# Altium project LMR_V1.PrjPcb
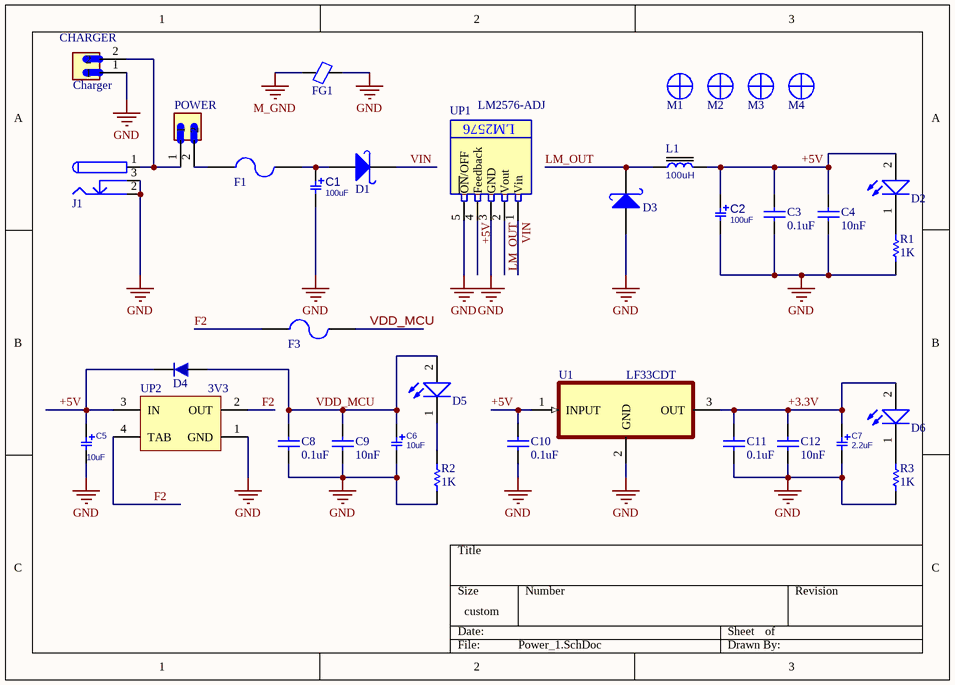
[diagram p0: Power_1.SchDoc]
6 sheets, 156 parts. Net scope: global (net labels, ports and power ports of the same name join across sheets).
Board file: Modified.PcbDoc
Sheets:
  Power_1.SchDoc
  Micro.SchDoc
  ETHERNET.SchDoc
  USB2Serial.SchDoc
  L298.SchDoc
  Prepherals.SchDoc

## Sheet Power_1.SchDoc
size 177 x 127 mm; SheetNumber: 1; SheetTotal: 6

### Parts
C1  100uF  [C_EL_10_10]
C2  100uF  [C_EL_10_10]
C3  0.1uF  [CAPC3413X12N]
C4  10nF  [CAPC3413X12N]
C5  10uF  [C_TN_6032]
C6  10uF  [C_TN_6032]
C7  2.2uF  [C_TN_6032]
C8  0.1uF  [CAPC3413X12N]
C9  10nF  [CAPC3413X12N]
C10  0.1uF  [CAPC3413X12N]
C11  0.1uF  [CAPC3413X12N]
C12  10nF  [CAPC3413X12N]
CHARGER  Charger  [JST_B2P-VH(LF)(SN)]
D1  1n5822  [DO-214AB(SMC)]  (value not drawn)
D2  LED SMD PACKAGE  [LED_SMD_0805]  (value not drawn)
D3  1n5822  [DO-214AB(SMC)]  (value not drawn)
D4  1n4007  [DIOM4629X24N]  (value not drawn)
D5  LED SMD PACKAGE  [LED_SMD_0805]  (value not drawn)
D6  LED SMD PACKAGE  [LED_SMD_0805]  (value not drawn)
F1  F=3A  [1206 FUSE]  (value not drawn)
F3  F=3A  [1206 FUSE]  (value not drawn)
FG1  Ferrite Bead SMD  [FB0805]  (value not drawn)
J1  DC Power Jack  [DC Power Jack 1]  (value not drawn)
L1  100uH  [L_12]
M1  Screw  [Board Screw 3mm]  (value not drawn)
M2  Screw  [Board Screw 3mm]  (value not drawn)
M3  Screw  [Board Screw 3mm]  (value not drawn)
M4  Screw  [Board Screw 3mm]  (value not drawn)
POWER  B2P-VH(LF)(SN)  [JST_B2P-VH(LF)(SN)]  (value not drawn)
R1  1K  [RESC3413X04N]
R2  1K  [RESC3413X04N]
R3  1K  [RESC3413X04N]
U1  LF33CDT  [TO228P972X240-3N]
UP1  LM2576-ADJ  [LM2576 SMD]
UP2  3V3  [SOT223]

### Nets
+3.3V: C7.1 C11.2 C12.2 D6.2(A) U1.3(OUT)
+5V: C2.1 C3.2 C4.2 C5.1 C10.2 D2.2(A) D4.2 L1.2 U1.1(INPUT) UP1.4(Feedback) UP2.3(IN)
GND: C1.2 C2.2 C3.1 C4.1 C5.2 C6.2 C7.2 C8.1 C9.1 C10.1 C11.1 C12.1 CHARGER.1 D3.1(A) FG1.2 J1.2 J1.3 R1.1 R2.1 R3.1 U1.2(GND) UP1.3(GND) UP1.5(~{ON}/OFF) UP2.1(GND)
M_GND: FG1.1
VDD_MCU: C6.1 C8.2 C9.2 D4.1 D5.2(A) F3.2
F2: F3.1 UP2.2(OUT) UP2.4(TAB)
LM_OUT: D3.2(K) L1.1 UP1.2(Vout)
VIN: D1.2(K) UP1.1(Vin)
NetC1_1: C1.1 D1.1(A) F1.2
NetCHARGER_2: CHARGER.2 J1.1 POWER.1
NetD2_1: D2.1(K) R1.2
NetD5_1: D5.1(K) R2.2
NetD6_1: D6.1(K) R3.2
NetF1_1: F1.1 POWER.2

### Notes on the sheet
- (in symbol LM2576-Adj) LM2576

### Library data of the parts
C1 C2 = CAP_SMD_EL: CAP, THD, ELEC,; MANF_P#: MANF_PART#; PARAM2: 20%; DESC: DESCRIPTION; DIST#: MOUSER; PARAM: 25V; PRICE: 10= 5$; MANF: MANF; ASSEMBLY: ASSEMBLY; VALUE: 100uF
C3 C4 C8-C12 = CAP SMD 0805: CAP 0805; Designer: Abbas Basereh; Desc.: CAP SMD 0805; Data: 16-12-2016
C5-C7 = CAP_SMD_TAN: CAP, SMD, TAN,; PARAM: 25V
  C5 C6: VALUE: 10uF
  C7: VALUE: 2.2uF
CHARGER POWER = B2P-VH(LF)(SN): Connector Header Through Hole 2 position 0.156 (3.96mm); MF: JST Sales; Price: None; Availability: In Stock; Package: None; MP: B2P-VH(LF)(SN); Value: *; SnapEDA_Link: https://www.snapeda.com/parts/B2P-VH(LF)(SN)/JST+Sales+America+Inc./view-part/?ref=snap; Purchase-URL: https://pricing.snapeda.com/search/part/B2P-VH(LF)(SN)/?ref=eda; Check_prices: https://www.snapeda.com/parts/B2P-VH(LF)(SN)/JST+Sales+America+Inc./view-part/?ref=eda
D1 D3 = 1N5822 SMD: Schottky Rectifiers; Part. No: SS34; Manufacturer: ON Semiconductor/Fairchild; Designer: Abbas Basereh; Link: https://www.aliexpress.com/item/Free-shipping-100pcs-1n5822-sma-smd-do-214ac-Schottky-diode-ss34/32337482329.html?spm=2114.01010208.3.1.zLZDsP&ws_ab_test=searchweb0_0,searchweb201602_4_10065_10068_10084_10083_10080_10082_10081_10060_10061_10062_10056_10055_10054_10059_10099_10078_10079_427_10073_10103_10102_10096_10052_10050_10051,searchweb201603_4&btsid=6e50dc92-ac69-45bc-a19e-209af19ce602; Link: http://www.tme.eu/en/details/ss34/smd-schottky-diodes/vishay/ss34-e357t/; Link: http://www.digikey.com/product-detail/en/on-semiconductor-fairchild/SS34/SS34FSCT-ND/2094459; Data: 16-12-2016
D2 D5 D6 = LED SMD PACKAGE: SMD Mono-color Chip LED Waterclear; Part Number: 150080BS75000; Peak Wavelength: 465 nm; Forward Voltage: 3.2 V; Published Date: Jan 2017; Publisher: Ali Hafizi
D4 = 1n4007 SMD M7: Standard Rectifiers; Part. No: M7; Manufacturer: DC COMPONENTS; Designer: Abbas Basereh; Link: http://www.tme.eu/en/details/m7/smd-universal-diodes/dc-components/; Link: https://www.aliexpress.com/item/Smd-tube-1n4007-m7-SMA/1213719741.html?spm=2114.01010208.3.1.ZyZ7bC&ws_ab_test=searchweb0_0,searchweb201602_4_10065_10068_10084_10083_10080_10082_10081_10060_10061_10062_10056_10055_10054_10059_10099_10078_10079_427_10073_10103_10102_10096_10052_10050_10051,searchweb201603_4&btsid=db2be5ca-e560-400a-b91c-484ab5ee228b; Data: 16-12-2016
F1 F3 = Fuse SMD1206: SMD Fuses 1206; Designer: Abbas Basereh; Desc.: SMD Fuses 1206; Data: 16-12-2016
FG1 = Ferrite Bead SMD Package: Designer: Ali Hafizi
J1 = DC Power Jack: DC Power Jack. Center Pin 2.5mm. Diameter: 5.7mm; Designer: Ali Hafizi; Company: Personal; Project Name: Laser; Adding Date: 10/21/2009
L1 = INDPWR_SMD: INDUCTOR, POWER, SMD; VALUE: 100uH
M1-M4 = Board Screw 3MM: Board Screw With Spacer
R1-R3 = RES 0805 0.125W: RES 0805; Designer: Abbas Basereh; Desc.: RES SMD 0805; Data: 16-12-2016
U1 = LF33CDT: Linear Voltage Regulator IC Positive Fixed 1 Output 500mA DPAK; MF: STMicroelectronics; MP: LF33CDT; Price: None; Purchase-URL: https://pricing.snapeda.com/search/part/LF33CDT/?ref=eda; Package: TO-252 STMicroelectronics; Check_prices: https://www.snapeda.com/parts/LF33CDT/STMicroelectronics/view-part/?ref=eda; Value: *; Availability: In Stock; SnapEDA_Link: https://www.snapeda.com/parts/LF33CDT/STMicroelectronics/view-part/?ref=snap
UP1 = LM2576-Adj: 1.2-50V, 3A variable output step-down switching voltage regulator; Designer: Abbas Basereh; Data: 16-12-2016; Link: *; Part.No: *; VALUE: LM2576-ADJ
UP2 = AMS1117-x.x: x.x Volt, 800mA Low-Dropout Linear Regulator, 4-pin SOT-223; Designer: Ali Hafizi; Data: 16-12-2016

## Sheet Micro.SchDoc
size 228 x 215 mm; SheetNumber: 2; SheetTotal: 6
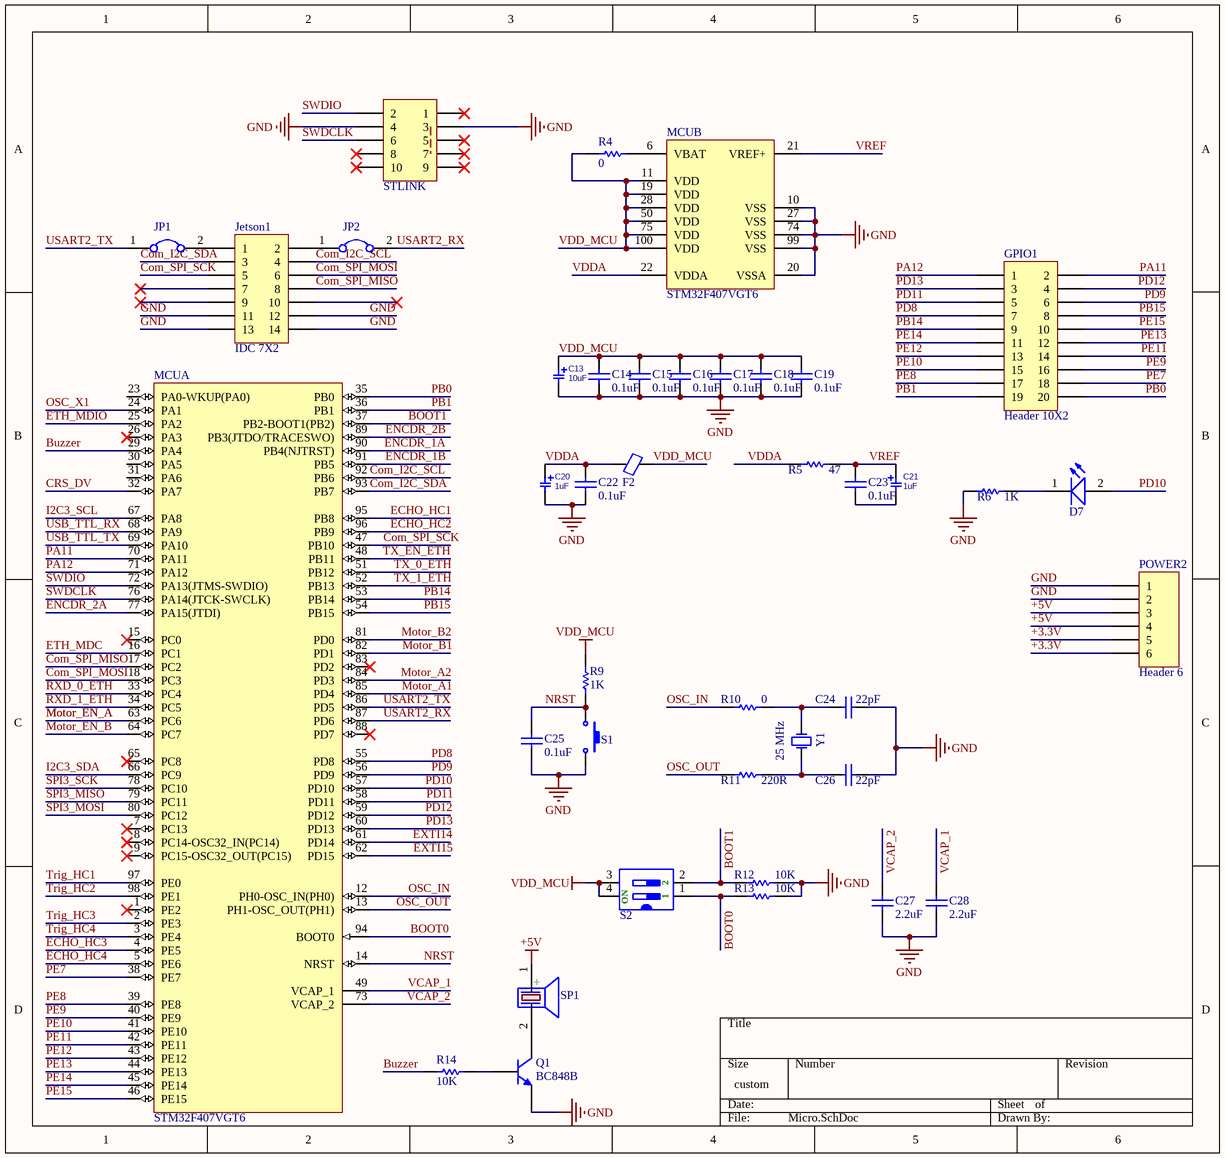
[diagram p1: Micro.SchDoc]

### Parts
C13  10uF  [C_TN_6032]
C14  0.1uF  [CAPC3413X12N]
C15  0.1uF  [CAPC3413X12N]
C16  0.1uF  [CAPC3413X12N]
C17  0.1uF  [CAPC3413X12N]
C18  0.1uF  [CAPC3413X12N]
C19  0.1uF  [CAPC3413X12N]
C20  1uF  [C_TN_6032]
C21  1uF  [C_TN_6032]
C22  0.1uF  [CAPC3413X12N]
C23  0.1uF  [CAPC3413X12N]
C24  22pF  [CAPC3413X12N]
C25  0.1uF  [CAPC3413X12N]
C26  22pF  [CAPC3413X12N]
C27  2.2uF  [CAPC3413X12N]
C28  2.2uF  [CAPC3413X12N]
D7  LED SMD PACKAGE  [LED_SMD_0805]  (value not drawn)
F2  Ferrite Bead SMD  [FB0805]  (value not drawn)
GPIO1  Header 10X2  [HDR2X10]
Jetson1  IDC 7X2  [IDC 7X2]
JP1  Jumper  [Jumper Small - 2.54 - GRAY]  (value not drawn)
JP2  Jumper  [Jumper Small - 2.54 - GRAY]  (value not drawn)
MCU  STM32F407VGT6  [STM-LQFP100_N]  (parts A,B of 2)
POWER2  Header 6  [HDR1X6]
Q1  BC848B  [SOT23_L]
R4  0  [RESC3413X04N]
R5  47  [RESC3413X04N]
R6  1K  [RESC3413X04N]
R9  1K  [RESC3413X04N]
R10  0  [RESC3413X04N]
R11  220R  [RESC3413X04N]
R12  10K  [RESC3413X04N]
R13  10K  [RESC3413X04N]
R14  10K  [RES0805_(2012X06L)]
S1  Switch PB  [SW-PB]  (value not drawn)
S2  SW_DIP_02  [SMV_DIP_CTS-219-02]  (value not drawn)
SP1  (no value)  [BUZZER 7.62mm DC]
STLINK  CONNECTOR_IDC_5X2  [IDC2.54-10PIN]  (value not drawn)
Y1  25 MHz  [Crystal SMD]

### Nets
+3.3V: POWER2.5 POWER2.6
+5V: POWER2.3 POWER2.4 SP1.1(+)
GND: C13.2 C14.1 C15.1 C16.1 C17.1 C18.1 C19.1 C20.2 C22.1 C24.1 C25.1 C26.1 C27.1 C28.1 Jetson1.11 Jetson1.12 Jetson1.13 Jetson1.14 MCU.10(VSS) MCU.20(VSSA) MCU.27(VSS) MCU.74(VSS) MCU.99(VSS) POWER2.1 POWER2.2 Q1.2(E) R6.1 R12.2 R13.2 S1.2 STLINK.3 STLINK.4
VDD_MCU: C13.1 C14.2 C15.2 C16.2 C17.2 C18.2 C19.2 F2.2 MCU.11(VDD) MCU.19(VDD) MCU.28(VDD) MCU.50(VDD) MCU.75(VDD) MCU.100(VDD) R4.1 R9.2 S2.3 S2.4
BOOT0: MCU.94(BOOT0) R13.1 S2.1
BOOT1: MCU.37(PB2-BOOT1(PB2)) R12.1 S2.2
Buzzer: MCU.29(PA4) R14.1
Com_I2C_SCL: Jetson1.4 MCU.92(PB6)
Com_I2C_SDA: Jetson1.3 MCU.93(PB7)
Com_SPI_MISO: Jetson1.8 MCU.17(PC2)
Com_SPI_MOSI: Jetson1.6 MCU.18(PC3)
Com_SPI_SCK: Jetson1.5 MCU.47(PB10)
CRS_DV: MCU.32(PA7)
ECHO_HC1: MCU.95(PB8)
ECHO_HC2: MCU.96(PB9)
ECHO_HC3: MCU.4(PE5)
ECHO_HC4: MCU.5(PE6)
ENCDR_1A: MCU.90(PB4(NJTRST))
ENCDR_1B: MCU.91(PB5)
ENCDR_2A: MCU.77(PA15(JTDI))
ENCDR_2B: MCU.89(PB3(JTDO/TRACESWO))
ETH_MDC: MCU.16(PC1)
ETH_MDIO: MCU.25(PA2)
EXTI14: MCU.61(PD14)
EXTI15: MCU.62(PD15)
I2C3_SCL: MCU.67(PA8)
I2C3_SDA: MCU.66(PC9)
Motor_A1: MCU.85(PD4)
Motor_A2: MCU.84(PD3)
Motor_B1: MCU.82(PD1)
Motor_B2: MCU.81(PD0)
Motor_EN_A: MCU.63(PC6)
Motor_EN_B: MCU.64(PC7)
NRST: C25.2 MCU.14(NRST) R9.1 S1.1
OSC_IN: MCU.12(PH0-OSC_IN(PH0)) R10.1
OSC_OUT: MCU.13(PH1-OSC_OUT(PH1)) R11.1
OSC_X1: MCU.24(PA1)
PA11: GPIO1.2 MCU.70(PA11)
PA12: GPIO1.1 MCU.71(PA12)
PB0: GPIO1.20 MCU.35(PB0)
PB1: GPIO1.19 MCU.36(PB1)
PB14: GPIO1.9 MCU.53(PB14)
PB15: GPIO1.8 MCU.54(PB15)
PD8: GPIO1.7 MCU.55(PD8)
PD9: GPIO1.6 MCU.56(PD9)
PD10: D7.2(A) MCU.57(PD10)
PD11: GPIO1.5 MCU.58(PD11)
PD12: GPIO1.4 MCU.59(PD12)
PD13: GPIO1.3 MCU.60(PD13)
PE7: GPIO1.18 MCU.38(PE7)
PE8: GPIO1.17 MCU.39(PE8)
PE9: GPIO1.16 MCU.40(PE9)
PE10: GPIO1.15 MCU.41(PE10)
PE11: GPIO1.14 MCU.42(PE11)
PE12: GPIO1.13 MCU.43(PE12)
PE13: GPIO1.12 MCU.44(PE13)
PE14: GPIO1.11 MCU.45(PE14)
PE15: GPIO1.10 MCU.46(PE15)
RXD_0_ETH: MCU.33(PC4)
RXD_1_ETH: MCU.34(PC5)
SPI3_MISO: MCU.79(PC11)
SPI3_MOSI: MCU.80(PC12)
SPI3_SCK: MCU.78(PC10)
SWDCLK: MCU.76(PA14(JTCK-SWCLK)) STLINK.6
SWDIO: MCU.72(PA13(JTMS-SWDIO)) STLINK.2
Trig_HC1: MCU.97(PE0)
Trig_HC2: MCU.98(PE1)
Trig_HC3: MCU.2(PE3)
Trig_HC4: MCU.3(PE4)
TX_0_ETH: MCU.51(PB12)
TX_1_ETH: MCU.52(PB13)
TX_EN_ETH: MCU.48(PB11)
USART2_RX: JP2.2 MCU.87(PD6)
USART2_TX: JP1.1 MCU.86(PD5)
USB_TTL_RX: MCU.68(PA9)
USB_TTL_TX: MCU.69(PA10)
VCAP_1: C28.2 MCU.49(VCAP_1)
VCAP_2: C27.2 MCU.73(VCAP_2)
VDDA: C20.1 C22.2 F2.1 MCU.22(VDDA) R5.1
VREF: C21.1 C23.2 MCU.21(VREF+) R5.2
NetC21_2: C21.2 C23.1
NetC24_2: C24.2 R10.2 Y1.2(OSC2)
NetC26_2: C26.2 R11.2 Y1.1(OSC1)
NetD7_1: D7.1(K) R6.2
NetJetson1_1: Jetson1.1 JP1.2
NetJetson1_2: Jetson1.2 JP2.1
NetMCU_6: MCU.6(VBAT) R4.2
NetQ1_1: Q1.1(B) R14.2
NetQ1_3: Q1.3(C) SP1.2(-)

Not connected (* = marked no-connect by the designer): Jetson1 7* 9* 10*; MCU 1(PE2)* 7(PC13)* 8(PC14-OSC32_IN(PC14))* 9(PC15-OSC32_OUT(PC15))* 15(PC0)* 23(PA0-WKUP(PA0)) 26(PA3)* 30(PA5) 31(PA6) 65(PC8)* 83(PD2)* 88(PD7)*; STLINK 1* 5* 7* 8* 9* 10*

### Notes on the sheet
- (in symbol SW_DIP_02) ON

### Library data of the parts
C13 C20 C21 = CAP_SMD_TAN: CAP, SMD, TAN,; PARAM: 25V
  C13: VALUE: 10uF
  C20 C21: VALUE: 1uF
C14-C19 C22-C28 = CAP SMD 0805: CAP 0805; Designer: Abbas Basereh; Desc.: CAP SMD 0805; Data: 16-12-2016
D7 = LED SMD PACKAGE: as D2 on sheet Power_1; Published Date: Jan 2017; Publisher: Ali Hafizi
F2 = Ferrite Bead SMD Package: Designer: Ali Hafizi
GPIO1 = Header 10X2: Header, 10-Pin, Dual row; LatestRevisionDate: 17-Jul-2002; LatestRevisionNote: Re-released for DXP Platform.; Publisher: Altium Limited
JP1 JP2 = Jumper: Company: E.P.I.L; Defualt State: Close; Design Date: 2011/11/02
MCU = STM32F407VGT6: ARM Cortex-M4 32-bit MCU+FPU, 210 DMIPS, 1024 kB Flash, 192 kB Internal RAM, 82 I/Os, 100-pin LQFP, -40 to 85 degC, Tray; Manufacturer: STMicroelectronics; D/A Converter: 2x12-bit; FLASH Size (Prog) (kB): 1024; I/Os (High Current): 82; Internal RAM Size (kB): 192; Operating Frequency(F) (Processor speed) (MHz): 168; Supply Voltage(Vcc) max (V): 3.6; Supply Voltage(Vcc) min (V): 1.8; DatasheetVersion: Rev. 4; PackageVersion: Rev. 1, 06/2013; PackageReference: LQFP100; PackageDescription: 100-Pin Low Profile Quad Flat Package, 14 x 14 mm Body, 0.5 mm Pitch; Supplier 1: Digi-Key; Supplier Part Number 1: 497-11605-ND; Supplier 2: Farnell; Supplier Part Number 2: 2064368; Supplier 3: Newark; Supplier Part Number 3: 73T2333; Supplier 4: Mouser; Supplier Part Number 4: 511-STM32F407VGT6; Core: ARM Cortex-M4; Packing: Tray; Mounting Technology: Surface Mount; PartNumber: STM32F407VGT6; ComponentLink1Description: Manufacturer URL; ComponentLink1URL: http://www.st.com/web/en/home.html; ComponentLink2Description: Datasheet; ComponentLink2URL: http://www.st.com/st-web-ui/static/active/en/resource/technical/document/datasheet/DM00037051.pdf; ComponentLink3Description: Package Specification; ComponentLink3URL: http://www.st.com/st-web-ui/static/active/en/resource/technical/document/data_brief/DM00071938.pdf
POWER2 = Header 6: Header, 6-Pin; LatestRevisionDate: 17-Jul-2002; LatestRevisionNote: Re-released for DXP Platform.; Publisher: Altium Limited
Q1 = BC848B: NPN General-purpose Transistor; Published: 2017-1-6; LatestRevisionDate: 12-Dec-2006; LatestRevisionNote: IPC-7351 Footprint Added.; DatasheetVersion: 4-Feb-2002; PackageVersion: 2017-1-6; PackageReference: SOT23; Publisher: Abbas Basereh; PackageDescription: 3-Pin SOT-23 Package 0.95 mm Pitch, 2.3 mm Lead Span; ComponentLink1Description: Manufacturer Link; ComponentLink1URL: http://www.semiconductors.philips.com/; ComponentLink2Description: Datasheet; ComponentLink2URL: http://www.semiconductors.philips.com/acrobat/datasheets/BC846_BC847_BC848_5.pdf
R4-R6 R9-R13 = RES 0805 0.125W: as R1 on sheet Power_1; Data: 16-12-2016
R14 = RES SMD PACKAGE: TOTAL SMD RESISTOR PACK; Designer: Abbas Basereh; Desc.: RES SMD PAKAGES; Data: 2017-3-10
S1 = Switch PB: Push Button Switch
SP1 = PIEZO BUZZER: PIEZO BUZZER ACTIVE; Designer: Abbas Basereh; Comment_1: SPEAKER AND BEEP; Design Date: 1395/11/14; ComponentLink2Description: Reference; PackageDescription: THD; Publisher: Abbas Basereh; Mounting Technology: THD; Pin Count: 2; Status: Unreleased
STLINK = IDC 5X2: IDC, 5-Pin, Dual row; Manufacturer: CHINA; designer: ABBAS BASEREH; Connector type: IDC5X2  PROGPIN; Max Current: mA; LatestRevisionDate: 1395-11-17; Publisher: ABBAS BASEREH; Mounting Technology: Through-Hole; Category: Connector; Pin Count: 10; Status: Unreleased; ComponentLink1Description: Datasheet; ComponentLink2Description: Reference; Update: 2017-2-4
Y1 = XTAL: XTAL Crystal; Designer: ABBAS BASEREH; Value: 12 MHz; Design Date: 2017-1-3; ComponentLink1Description: Datasheet; ComponentLink2Description: Reference; Mounting Technology: Surface Mount\Through-Hole; Status: Unreleased

## Sheet ETHERNET.SchDoc
size 381 x 139 mm; SheetNumber: 3; SheetTotal: 6
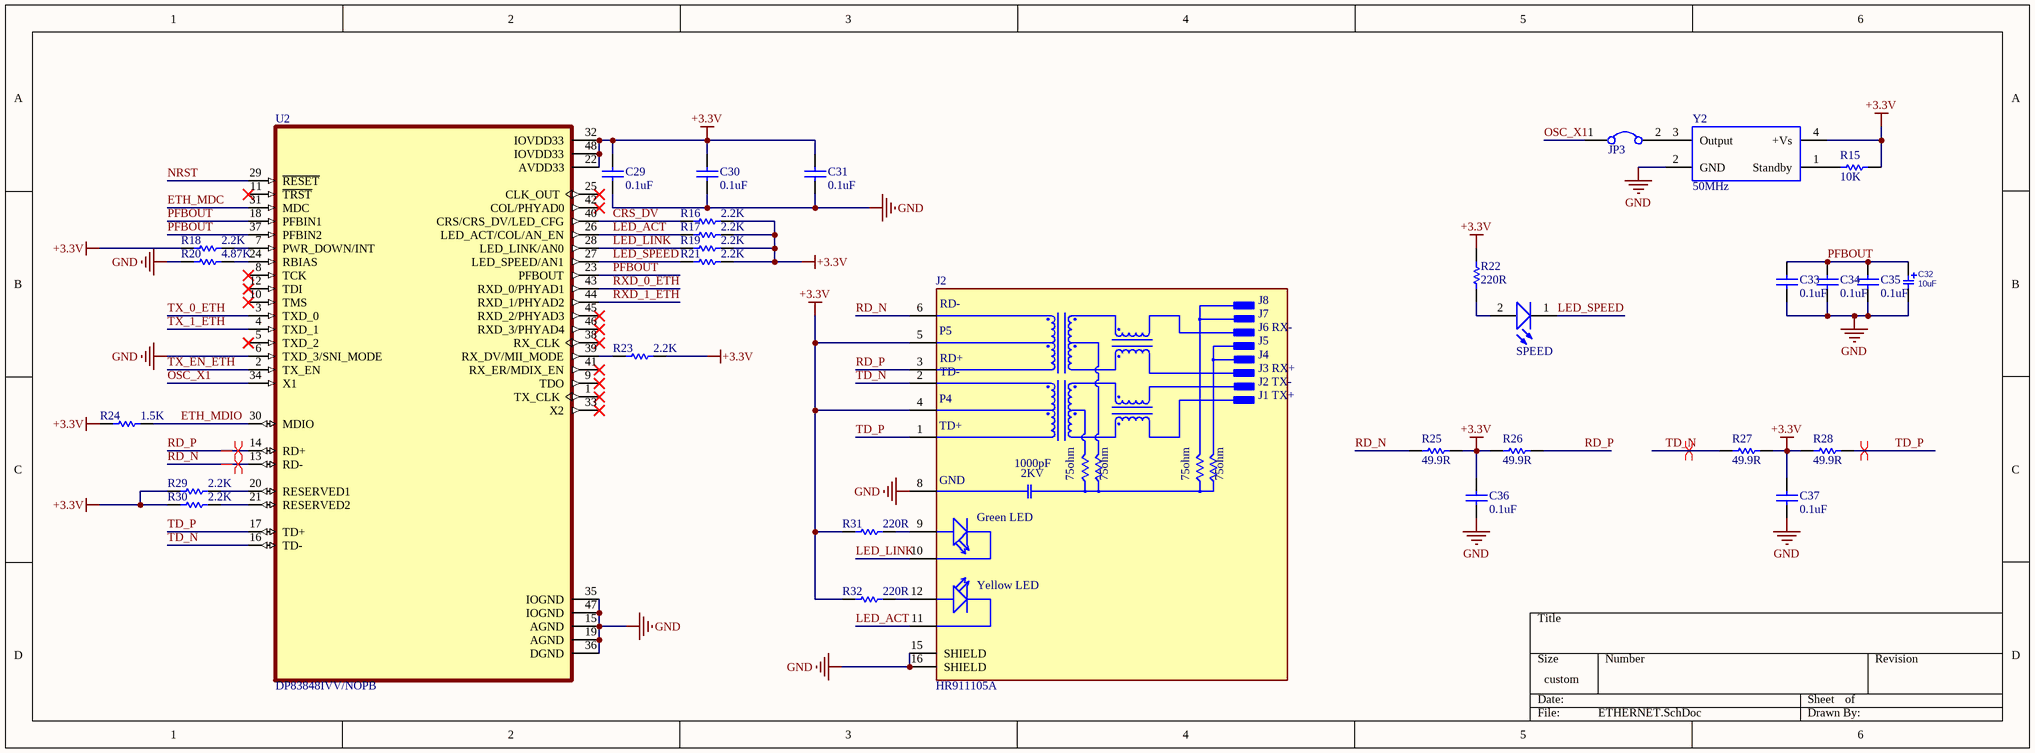
[diagram p2: ETHERNET.SchDoc]

### Parts
C29  0.1uF  [CAPC3413X12N]
C30  0.1uF  [CAPC3413X12N]
C31  0.1uF  [CAPC3413X12N]
C32  10uF  [C_TN_6032]
C33  0.1uF  [CAPC3413X12N]
C34  0.1uF  [CAPC3413X12N]
C35  0.1uF  [CAPC3413X12N]
C36  0.1uF  [CAPC3413X12N]
C37  0.1uF  [CAPC3413X12N]
J2  HR911105A  [HANRUN_HR911105A]
JP3  Jumper  [Jumper Small - 2.54 - GRAY]  (value not drawn)
R15  10K  [RESC3413X04N]
R16  2.2K  [RESC3413X04N]
R17  2.2K  [RESC3413X04N]
R18  2.2K  [RESC3413X04N]
R19  2.2K  [RESC3413X04N]
R20  4.87K  [RESC3413X04N]
R21  2.2K  [RESC3413X04N]
R22  220R  [RESC3413X04N]
R23  2.2K  [RESC3413X04N]
R24  1.5K  [RESC3413X04N]
R25  49.9R  [RESC3413X04N]
R26  49.9R  [RESC3413X04N]
R27  49.9R  [RESC3413X04N]
R28  49.9R  [RESC3413X04N]
R29  2.2K  [RESC3413X04N]
R30  2.2K  [RESC3413X04N]
R31  220R  [RESC3413X04N]
R32  220R  [RESC3413X04N]
SPEED  LED SMD PACKAGE  [LED_SMD_0805]  (value not drawn)
U2  DP83848IVV/NOPB  [LQFP-48]
Y2  50MHz  [WE-SPXO_CFPS-72]

### Nets
+3.3V: C29.2 C30.2 C31.2 C36.2 C37.2 J2.4(P4) J2.5(P5) R15.2 R16.2 R17.2 R18.1 R19.2 R21.2 R22.2 R23.2 R24.1 R25.2 R26.1 R27.2 R28.1 R29.1 R30.1 R31.1 R32.1 U2.22(AVDD33) U2.32(IOVDD33) U2.48(IOVDD33) Y2.4(+Vs)
GND: C29.1 C30.1 C31.1 C32.2 C33.1 C34.1 C35.1 C36.1 C37.1 J2.8(GND) J2.15(SHIELD) J2.16(SHIELD) R20.1 U2.6(TXD_3/SNI_MODE) U2.15(AGND) U2.19(AGND) U2.35(IOGND) U2.36(DGND) U2.47(IOGND) Y2.2(GND)
CRS_DV: R16.1 U2.40(CRS/CRS_DV/LED_CFG)
ETH_MDC: U2.31(MDC)
ETH_MDIO: R24.2 U2.30(MDIO)
LED_ACT: J2.11(YC) R17.1 U2.26(LED_ACT/COL/AN_EN)
LED_LINK: J2.10(GC) R19.1 U2.28(LED_LINK/AN0)
LED_SPEED: R21.1 SPEED.1(K) U2.27(LED_SPEED/AN1)
NRST: U2.29(~{RESET})
OSC_X1: JP3.1 U2.34(X1)
PFBOUT: C32.1 C33.2 C34.2 C35.2 U2.18(PFBIN1) U2.23(PFBOUT) U2.37(PFBIN2)
RD_N: J2.6(RD-) R25.1 U2.13(RD-)
RD_P: J2.3(RD+) R26.2 U2.14(RD+)
RXD_0_ETH: U2.43(RXD_0/PHYAD1)
RXD_1_ETH: U2.44(RXD_1/PHYAD2)
TD_N: J2.2(TD-) R27.1 U2.16(TD-)
TD_P: J2.1(TD+) R28.2 U2.17(TD+)
TX_0_ETH: U2.3(TXD_0)
TX_1_ETH: U2.4(TXD_1)
TX_EN_ETH: U2.2(TX_EN)
NetJ2_9: J2.9(GA) R31.2
NetJ2_12: J2.12(YA) R32.2
NetJP3_2: JP3.2 Y2.3(Output)
NetR15_1: R15.1 Y2.1(Standby)
NetR18_2: R18.2 U2.7(PWR_DOWN/INT)
NetR20_2: R20.2 U2.24(RBIAS)
NetR22_1: R22.1 SPEED.2(A)
NetR23_1: R23.1 U2.39(RX_DV/MII_MODE)
NetR29_2: R29.2 U2.20(RESERVED1)
NetR30_2: R30.2 U2.21(RESERVED2)

Not connected (* = marked no-connect by the designer): U2 1(TX_CLK)* 5(TXD_2)* 8(TCK)* 9(TDO)* 10(TMS)* 11(~{TRST})* 12(TDI)* 25(CLK_OUT)* 33(X2)* 38(RX_CLK)* 41(RX_ER/MDIX_EN)* 42(COL/PHYAD0)* 45(RXD_2/PHYAD3)* 46(RXD_3/PHYAD4)*

### Layout directives
differential pair: RD_N, RD_P, TD_N, TD_P

### Notes on the sheet
- (in symbol HR911105A) J8; J7; J6 RX-; J5; J4; J3 RX+; J2 TX-; J1 TX+; 1000pF; 2KV; 75ohm; Green LED; Yellow LED

### Library data of the parts
C29-C31 C33-C37 = CAP SMD 0805: CAP 0805; Designer: Abbas Basereh; Desc.: CAP SMD 0805; Data: 16-12-2016
C32 = CAP_SMD_TAN: CAP, SMD, TAN,; PARAM: 25V; VALUE: 10uF
J2 = HR911105A: DIP RJ45 Connector;; MF: hanrun; SnapEDA_Link: https://www.snapeda.com/parts/HR911105A/HanRun/view-part/?ref=snap; Package: None; MP: HR911105A; Check_prices: https://www.snapeda.com/parts/HR911105A/HanRun/view-part/?ref=eda; Price: None; Value: *; Availability: Not in stock
JP3 = Jumper: Company: E.P.I.L; Defualt State: Close; Design Date: 2011/11/02
R15-R32 = RES 0805 0.125W: as R1 on sheet Power_1; Data: 16-12-2016
SPEED = LED SMD PACKAGE: as D2 on sheet Power_1; Published Date: Jan 2017; Publisher: Ali Hafizi
U2 = DP83848IVV/NOPB: Industrial temperature, 10/100-Mbps Ethernet PHY transceiver with SNI & JTAG support 48-LQFP -40 to 85; MF: Texas Instruments; DigiKey-Purchase-URL: https://snapeda.com/shop?store=DigiKey&id=45764; Package: LQFP-48 Texas Instruments; Arrow_Electronics-Purchase-URL: https://snapeda.com/shop?store=Arrow+Electronics&id=45764; MP: DP83848IVV/NOPB; Value: *; Texas_Instruments-Purchase-URL: https://snapeda.com/shop?store=Texas+Instruments&id=45764; Availability: Good; Price: None; SnapEDA_Link: https://www.snapeda.com/parts/DP83848IVV/NOPB/Texas%20Instruments/view-part/45764/?ref=snap; Mouser-Purchase-URL: https://snapeda.com/shop?store=Mouser&id=45764
Y2 = 831009443: WE-SPXO Simple Packaged Quartz Oscillator, SMT, CFPS-72, 80MHz, 5V; Manufacturer: Wurth Elektronik; Frequency Stability: +/-50ppm; ComponentLink1URL: http://www.we-online.de; ComponentLink2URL: https://katalog.we-online.com/pbs/datasheet/831009443.pdf; Supply Voltage: 5V; Size: CFPS-72; Packaging: Tape and Reel; Operating Temperature: 0 to +70degC; Mounting Technology: SMT; Published Date: July 2020; ComponentLink1Description: Manufacturer; Manufacturer Part Number: 831009443; Frequency: 80MHz; ComponentLink2Description: Datasheet

## Sheet USB2Serial.SchDoc
size 190 x 127 mm; SheetNumber: 4; SheetTotal: 6
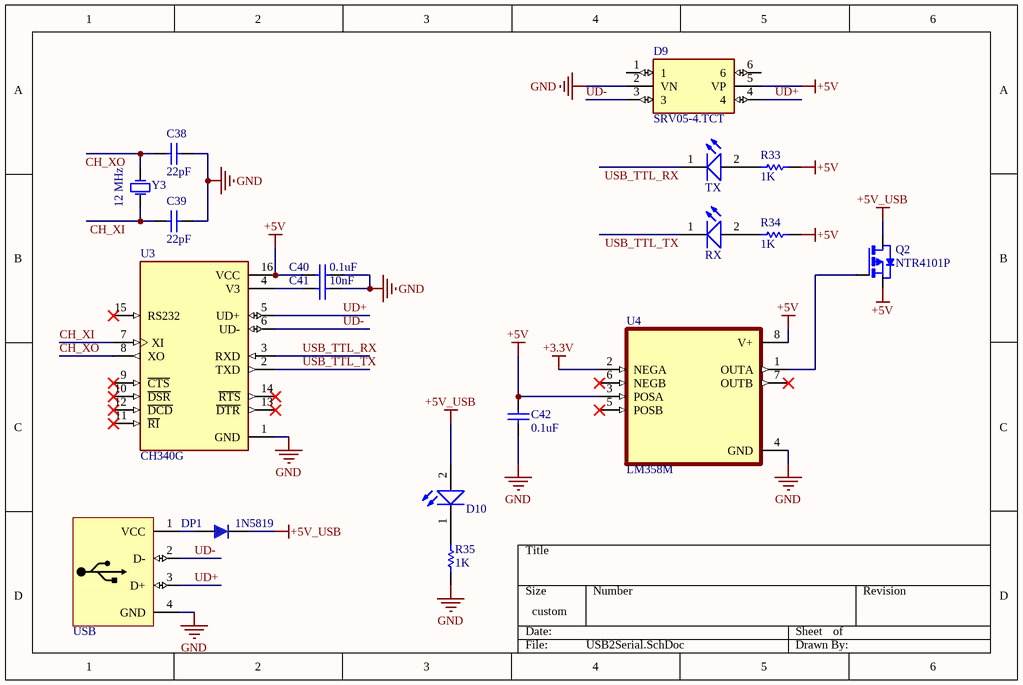
[diagram p3: USB2Serial.SchDoc]

### Parts
C38  22pF  [CAPC3413X12N]
C39  22pF  [CAPC3413X12N]
C40  0.1uF  [CAPC3413X12N]
C41  10nF  [CAPC3413X12N]
C42  0.1uF  [CAPC3413X12N]
D9  SRV05-4.TCT  [SOT95P280X145-6N]
D10  LED SMD PACKAGE  [LED_SMD_0805]  (value not drawn)
DP1  1N5819  [430X270D]
Q2  NTR4101P  [SOT23]
R33  1K  [RESC3413X04N]
R34  1K  [RESC3413X04N]
R35  1K  [RESC3413X04N]
RX  LED SMD PACKAGE  [LED_SMD_0805]  (value not drawn)
TX  LED SMD PACKAGE  [LED_SMD_0805]  (value not drawn)
U3  CH340G  [SOIC127P600X180-16N]
U4  LM358M  [SOIC127P599X175-8N]
USB  USB Connector  [USB2.5-2H4E]  (value not drawn)
Y3  12 MHz  [Crystal SMD]

### Nets
+3.3V: U4.2(NEGA)
+5V: C40.2 C42.2 D9.5(VP) Q2.2(S) R33.1 R34.1 U3.16(VCC) U4.3(POSA) U4.8(V+)
+5V_USB: D10.2(A) DP1.2 Q2.3(D)
GND: C38.1 C39.1 C40.1 C41.1 C42.1 D9.2(VN) R35.1 U3.1(GND) U4.4(GND) USB.4(GND)
CH_XI: C39.2 U3.7(XI) Y3.1(OSC1)
CH_XO: C38.2 U3.8(XO) Y3.2(OSC2)
UD+: D9.4 U3.5(UD+) USB.3(D+)
UD-: D9.3 U3.6(UD-) USB.2(D-)
USB_TTL_RX: TX.1(K) U3.3(RXD)
USB_TTL_TX: RX.1(K) U3.2(TXD)
NetC41_2: C41.2 U3.4(V3)
NetD10_1: D10.1(K) R35.2
NetDP1_1: DP1.1 USB.1(VCC)
NetQ2_1: Q2.1(G) U4.1(OUTA)
NetR33_2: R33.2 TX.2(A)
NetR34_2: R34.2 RX.2(A)

Not connected (* = marked no-connect by the designer): D9 1 6; U3 9(~{CTS})* 10(~{DSR})* 11(~{RI})* 12(~{DCD})* 13(~{DTR})* 14(~{RTS})* 15(RS232)*; U4 5(POSB)* 6(NEGB)* 7(OUTB)*

### Library data of the parts
C38-C42 = CAP SMD 0805: CAP 0805; Designer: Abbas Basereh; Desc.: CAP SMD 0805; Data: 16-12-2016
D9 = SRV05-4.TCT: 17.5V Clamp 12A (8/20Âµs) Ipp Tvs Diode Surface Mount SOT-23-6; MF: Semtech; Package: SOT-23 Semtech; Price: None; Value: *; SnapEDA_Link: https://www.snapeda.com/parts/SRV05-4.TCT/Semtech+Corporation/view-part/?ref=snap; MP: SRV05-4.TCT; Availability: In Stock; Check_prices: https://www.snapeda.com/parts/SRV05-4.TCT/Semtech+Corporation/view-part/?ref=eda
D10 RX TX = LED SMD PACKAGE: as D2 on sheet Power_1; Published Date: Jan 2017; Publisher: Ali Hafizi
DP1 = 1N5819: Schottkey Rectifiers; Designer: Abbas Basereh; Data: 16-12-2016; Link: *; Part. No: *
Q2 = NTR4101P: P-Channel 20V 1.8A _Ta_ 420mW _Ta_ Surface Mount SOT-23-3 _TO-236_; MF: ON Semiconductor; SnapEDA_Link: https://www.snapeda.com/parts/NTR4101P/ON%20Semiconductor/view-part/4001076/?ref=snap; Price: None; MP: NTR4101P; Package: SOT-23 ON Semiconductor; Value: *; Availability: Unavailable
R33-R35 = RES 0805 0.125W: as R1 on sheet Power_1; Data: 16-12-2016
U3 = CH340G: USB Interface Integrated Circuit; MF: WCH; Value: *; SnapEDA_Link: https://www.snapeda.com/parts/Ch340G/WCH/view-part/?ref=snap; MP: Ch340G; Check_prices: https://www.snapeda.com/parts/Ch340G/WCH/view-part/?ref=eda; Availability: Not in stock; Price: None; Package: None
U4 = LM358M: 2-Channel, 1MHz, industry standard, 32V op amp 8-SOIC 0 to 70; MF: Texas Instruments; SnapEDA_Link: https://www.snapeda.com/parts/LM358M/Texas+Instruments/view-part/?ref=snap; Purchase-URL: https://pricing.snapeda.com/search/part/LM358M/?ref=eda; Value: *; MP: LM358M; Availability: In Stock; Check_prices: https://www.snapeda.com/parts/LM358M/Texas+Instruments/view-part/?ref=eda; Package: SOIC-8 Texas Instruments; Price: None
USB = USB B-Type: USB Connector-B Type; Adding Date: 10/26/2010
Y3 = XTAL: XTAL Crystal; Designer: ABBAS BASEREH; Design Date: 2017-1-3; ComponentLink1Description: Datasheet; ComponentLink2Description: Reference; Mounting Technology: Surface Mount\Through-Hole; Value: 12 MHz; Status: Unreleased

## Sheet L298.SchDoc
size 215 x 78 mm; SheetNumber: 5; SheetTotal: 6
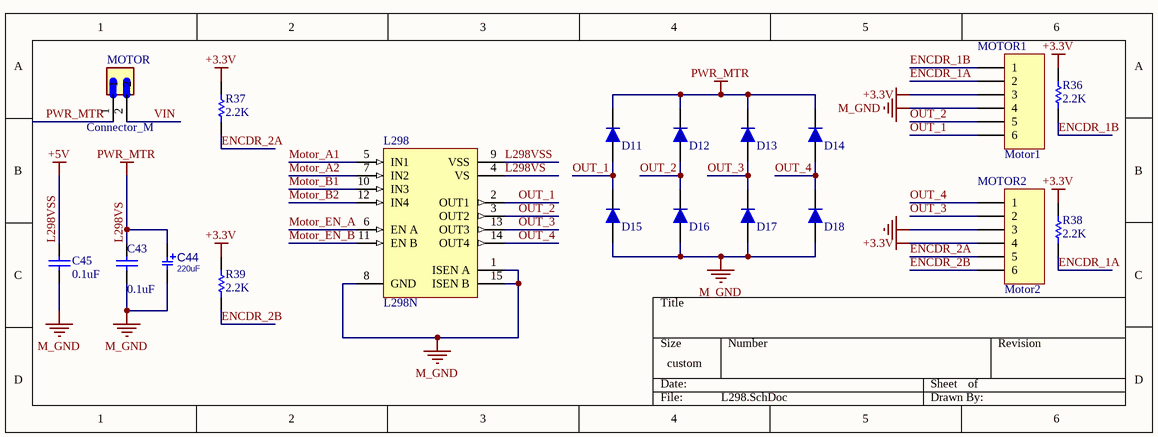
[diagram p4: L298.SchDoc]

### Parts
C43  0.1uF  [CAPC3413X12N]
C44  220uF  [C_EL_6_6]
C45  0.1uF  [CAPC3413X12N]
D11  1n4007  [DIOM4629X24N]  (value not drawn)
D12  1n4007  [DIOM4629X24N]  (value not drawn)
D13  1n4007  [DIOM4629X24N]  (value not drawn)
D14  1n4007  [DIOM4629X24N]  (value not drawn)
D15  1n4007  [DIOM4629X24N]  (value not drawn)
D16  1n4007  [DIOM4629X24N]  (value not drawn)
D17  1n4007  [DIOM4629X24N]  (value not drawn)
D18  1n4007  [DIOM4629X24N]  (value not drawn)
L298  L298N  [Multiwatt15H]
MOTOR  Connector_M  [JST_B2P-VH(LF)(SN)]
MOTOR1  Motor1  [MO-Header 6]
MOTOR2  Motor2  [MO-Header 6]
R36  2.2K  [RESC3413X04N]
R37  2.2K  [RESC3413X04N]
R38  2.2K  [RESC3413X04N]
R39  2.2K  [RESC3413X04N]

### Nets
+3.3V: MOTOR1.3 MOTOR2.4 R36.1 R37.1 R38.1 R39.1
+5V: C45.2 L298.9(VSS)  [also labelled L298VSS]
L298VS: C43.2 C44.1 D11.2 D12.2 D13.2 D14.2 L298.4(VS) MOTOR.1  [also labelled PWR_MTR]
M_GND: C43.1 C44.2 C45.1 D15.1 D16.1 D17.1 D18.1 L298.1(ISEN_A) L298.8(GND) L298.15(ISEN_B) MOTOR1.4 MOTOR2.3
ENCDR_1A: MOTOR1.2 R38.2
ENCDR_1B: MOTOR1.1 R36.2
ENCDR_2A: MOTOR2.5 R37.2
ENCDR_2B: MOTOR2.6 R39.2
Motor_A1: L298.5(IN1)
Motor_A2: L298.7(IN2)
Motor_B1: L298.10(IN3)
Motor_B2: L298.12(IN4)
Motor_EN_A: L298.6(EN_A)
Motor_EN_B: L298.11(EN_B)
OUT_1: D11.1 D15.2 L298.2(OUT1) MOTOR1.6
OUT_2: D12.1 D16.2 L298.3(OUT2) MOTOR1.5
OUT_3: D13.1 D17.2 L298.13(OUT3) MOTOR2.2
OUT_4: D14.1 D18.2 L298.14(OUT4) MOTOR2.1
VIN: MOTOR.2

### Library data of the parts
C43 C45 = CAP SMD 0805: CAP 0805; Designer: Abbas Basereh; Desc.: CAP SMD 0805; Data: 16-12-2016
C44 = CAP_SMD_EL: as C1 on sheet Power_1; PRICE: 10= 5$; MANF: MANF; ASSEMBLY: ASSEMBLY; VALUE: 220uF
D11-D18 = 1n4007 SMD M7: as D4 on sheet Power_1; Link: http://www.tme.eu/en/details/m7/smd-universal-diodes/dc-components/; Link: https://www.aliexpress.com/item/Smd-tube-1n4007-m7-SMA/1213719741.html?spm=2114.01010208.3.1.ZyZ7bC&ws_ab_test=searchweb0_0,searchweb201602_4_10065_10068_10084_10083_10080_10082_10081_10060_10061_10062_10056_10055_10054_10059_10099_10078_10079_427_10073_10103_10102_10096_10052_10050_10051,searchweb201603_4&btsid=db2be5ca-e560-400a-b91c-484ab5ee228b; Data: 16-12-2016
L298 = L298N: Dual Full Bridge Driver; Revision 1: 24-Aug-2001: Footprint Added.; Revision 2: 17-Jul-2002: Re-released for DXP Platform.; Package Information: Latest Revision: Apr-1998; Published: 8-Jun-2000; Datasheet: Latest Revision: Jul-1999; Package Reference: Multiwatt15H; Publisher: Altium Limited
MOTOR = B2P-VH(LF)(SN): as CHARGER on sheet Power_1; Price: None; Availability: In Stock; Package: None; MP: B2P-VH(LF)(SN); Value: *; SnapEDA_Link: https://www.snapeda.com/parts/B2P-VH(LF)(SN)/JST+Sales+America+Inc./view-part/?ref=snap; Purchase-URL: https://pricing.snapeda.com/search/part/B2P-VH(LF)(SN)/?ref=eda; Check_prices: https://www.snapeda.com/parts/B2P-VH(LF)(SN)/JST+Sales+America+Inc./view-part/?ref=eda
MOTOR1 MOTOR2 = Header 6: Header, 6-Pin; LatestRevisionDate: 17-Jul-2002; LatestRevisionNote: Re-released for DXP Platform.; Publisher: Altium Limited
R36-R39 = RES 0805 0.125W: as R1 on sheet Power_1; Data: 16-12-2016

## Sheet Prepherals.SchDoc
size 152 x 152 mm; SheetNumber: 6; SheetTotal: 6
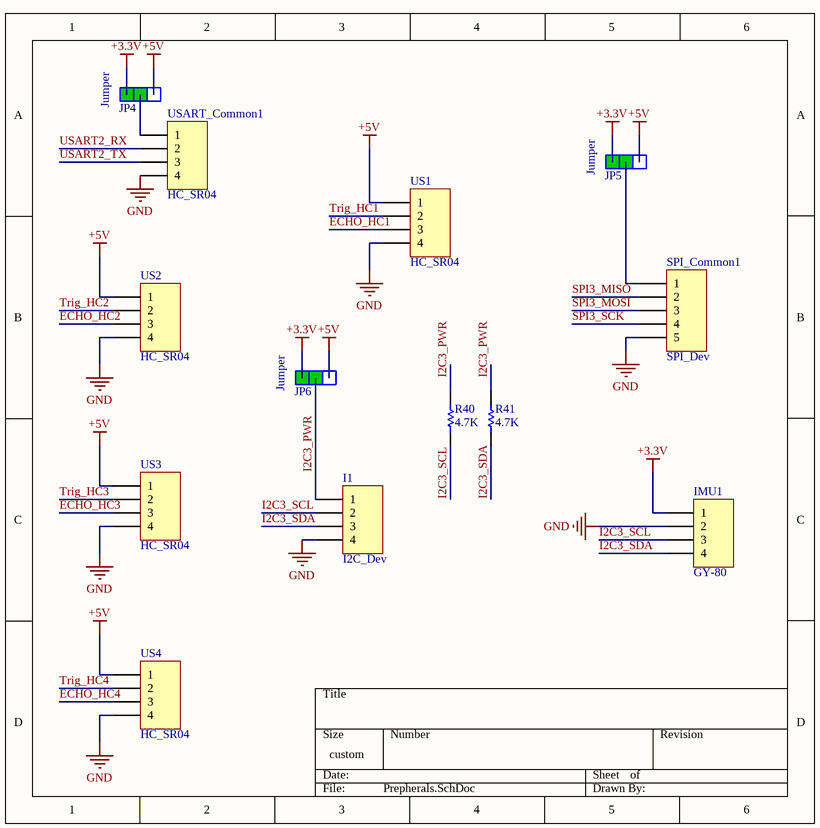
[diagram p5: Prepherals.SchDoc]

### Parts
I1  I2C_Dev  [XH Connector 4-Pin]
IMU1  GY-80  [XH Connector 4-Pin]
JP4  Jumper  [jumper selector]
JP5  Jumper  [jumper selector]
JP6  Jumper  [jumper selector]
R40  4.7K  [RESC3413X04N]
R41  4.7K  [RESC3413X04N]
SPI_Common1  SPI_Dev  [MO-Header 5]
US1  HC_SR04  [XH Connector 4-Pin]
US2  HC_SR04  [XH Connector 4-Pin]
US3  HC_SR04  [XH Connector 4-Pin]
US4  HC_SR04  [XH Connector 4-Pin]
USART_Common1  HC_SR04  [XH Connector 4-Pin]

### Nets
+3.3V: IMU1.1 JP4.1 JP5.1 JP6.1
+5V: JP4.3 JP5.3 JP6.3 US1.1 US2.1 US3.1 US4.1
GND: I1.4 IMU1.2 SPI_Common1.5 US1.4 US2.4 US3.4 US4.4 USART_Common1.4
ECHO_HC1: US1.3
ECHO_HC2: US2.3
ECHO_HC3: US3.3
ECHO_HC4: US4.3
I2C3_PWR: I1.1 JP6.2 R40.2 R41.2
I2C3_SCL: I1.2 IMU1.3 R40.1
I2C3_SDA: I1.3 IMU1.4 R41.1
SPI3_MISO: SPI_Common1.2
SPI3_MOSI: SPI_Common1.3
SPI3_SCK: SPI_Common1.4
Trig_HC1: US1.2
Trig_HC2: US2.2
Trig_HC3: US3.2
Trig_HC4: US4.2
USART2_RX: USART_Common1.2
USART2_TX: USART_Common1.3
NetJP4_2: JP4.2 USART_Common1.1
NetJP5_2: JP5.2 SPI_Common1.1

### Library data of the parts
I1 IMU1 US1-US4 USART_Common1 = Header 4 PIN Telecom.: Header, 4-Pin Telecom.; Designer: Abbas Basereh; Data: 16-12-2016; Link: *; Part. No: *
JP4-JP6 = Jumper Selector
R40 R41 = RES 0805 0.125W: as R1 on sheet Power_1; Data: 16-12-2016
SPI_Common1 = Header 5: Header, 5-Pin; LatestRevisionDate: 17-Jul-2002; LatestRevisionNote: Re-released for DXP Platform.; Publisher: Altium Limited

## Nets that join several sheets
+3.3V: Power_1 (5 pins), Micro (POWER2.5 POWER2.6), ETHERNET (28 pins), USB2Serial (U4.2), L298 (6 pins), Prepherals (IMU1.1 JP4.1 JP5.1 JP6.1)
+5V: Power_1 (11 pins), Micro (POWER2.3 POWER2.4 SP1.1), USB2Serial (9 pins), L298 (C45.2 L298.9), Prepherals (7 pins)
GND: Power_1 (24 pins), Micro (32 pins), ETHERNET (20 pins), USB2Serial (10 pins), Prepherals (8 pins)
M_GND: Power_1 (FG1.1), L298 (12 pins)
VDD_MCU: Power_1 (6 pins), Micro (18 pins)
CRS_DV: Micro (MCU.32), ETHERNET (R16.1 U2.40)
ECHO_HC1: Micro (MCU.95), Prepherals (US1.3)
ECHO_HC2: Micro (MCU.96), Prepherals (US2.3)
ECHO_HC3: Micro (MCU.4), Prepherals (US3.3)
ECHO_HC4: Micro (MCU.5), Prepherals (US4.3)
ENCDR_1A: Micro (MCU.90), L298 (MOTOR1.2 R38.2)
ENCDR_1B: Micro (MCU.91), L298 (MOTOR1.1 R36.2)
ENCDR_2A: Micro (MCU.77), L298 (MOTOR2.5 R37.2)
ENCDR_2B: Micro (MCU.89), L298 (MOTOR2.6 R39.2)
ETH_MDC: Micro (MCU.16), ETHERNET (U2.31)
ETH_MDIO: Micro (MCU.25), ETHERNET (R24.2 U2.30)
I2C3_SCL: Micro (MCU.67), Prepherals (I1.2 IMU1.3 R40.1)
I2C3_SDA: Micro (MCU.66), Prepherals (I1.3 IMU1.4 R41.1)
Motor_A1: Micro (MCU.85), L298 (L298.5)
Motor_A2: Micro (MCU.84), L298 (L298.7)
Motor_B1: Micro (MCU.82), L298 (L298.10)
Motor_B2: Micro (MCU.81), L298 (L298.12)
Motor_EN_A: Micro (MCU.63), L298 (L298.6)
Motor_EN_B: Micro (MCU.64), L298 (L298.11)
NRST: Micro (C25.2 MCU.14 R9.1 S1.1), ETHERNET (U2.29)
OSC_X1: Micro (MCU.24), ETHERNET (JP3.1 U2.34)
RXD_0_ETH: Micro (MCU.33), ETHERNET (U2.43)
RXD_1_ETH: Micro (MCU.34), ETHERNET (U2.44)
SPI3_MISO: Micro (MCU.79), Prepherals (SPI_Common1.2)
SPI3_MOSI: Micro (MCU.80), Prepherals (SPI_Common1.3)
SPI3_SCK: Micro (MCU.78), Prepherals (SPI_Common1.4)
Trig_HC1: Micro (MCU.97), Prepherals (US1.2)
Trig_HC2: Micro (MCU.98), Prepherals (US2.2)
Trig_HC3: Micro (MCU.2), Prepherals (US3.2)
Trig_HC4: Micro (MCU.3), Prepherals (US4.2)
TX_0_ETH: Micro (MCU.51), ETHERNET (U2.3)
TX_1_ETH: Micro (MCU.52), ETHERNET (U2.4)
TX_EN_ETH: Micro (MCU.48), ETHERNET (U2.2)
USART2_RX: Micro (JP2.2 MCU.87), Prepherals (USART_Common1.2)
USART2_TX: Micro (JP1.1 MCU.86), Prepherals (USART_Common1.3)
USB_TTL_RX: Micro (MCU.68), USB2Serial (TX.1 U3.3)
USB_TTL_TX: Micro (MCU.69), USB2Serial (RX.1 U3.2)
VIN: Power_1 (D1.2 UP1.1), L298 (MOTOR.2)